# Altium schematic sheet Sheet1.SchDoc
size Letter
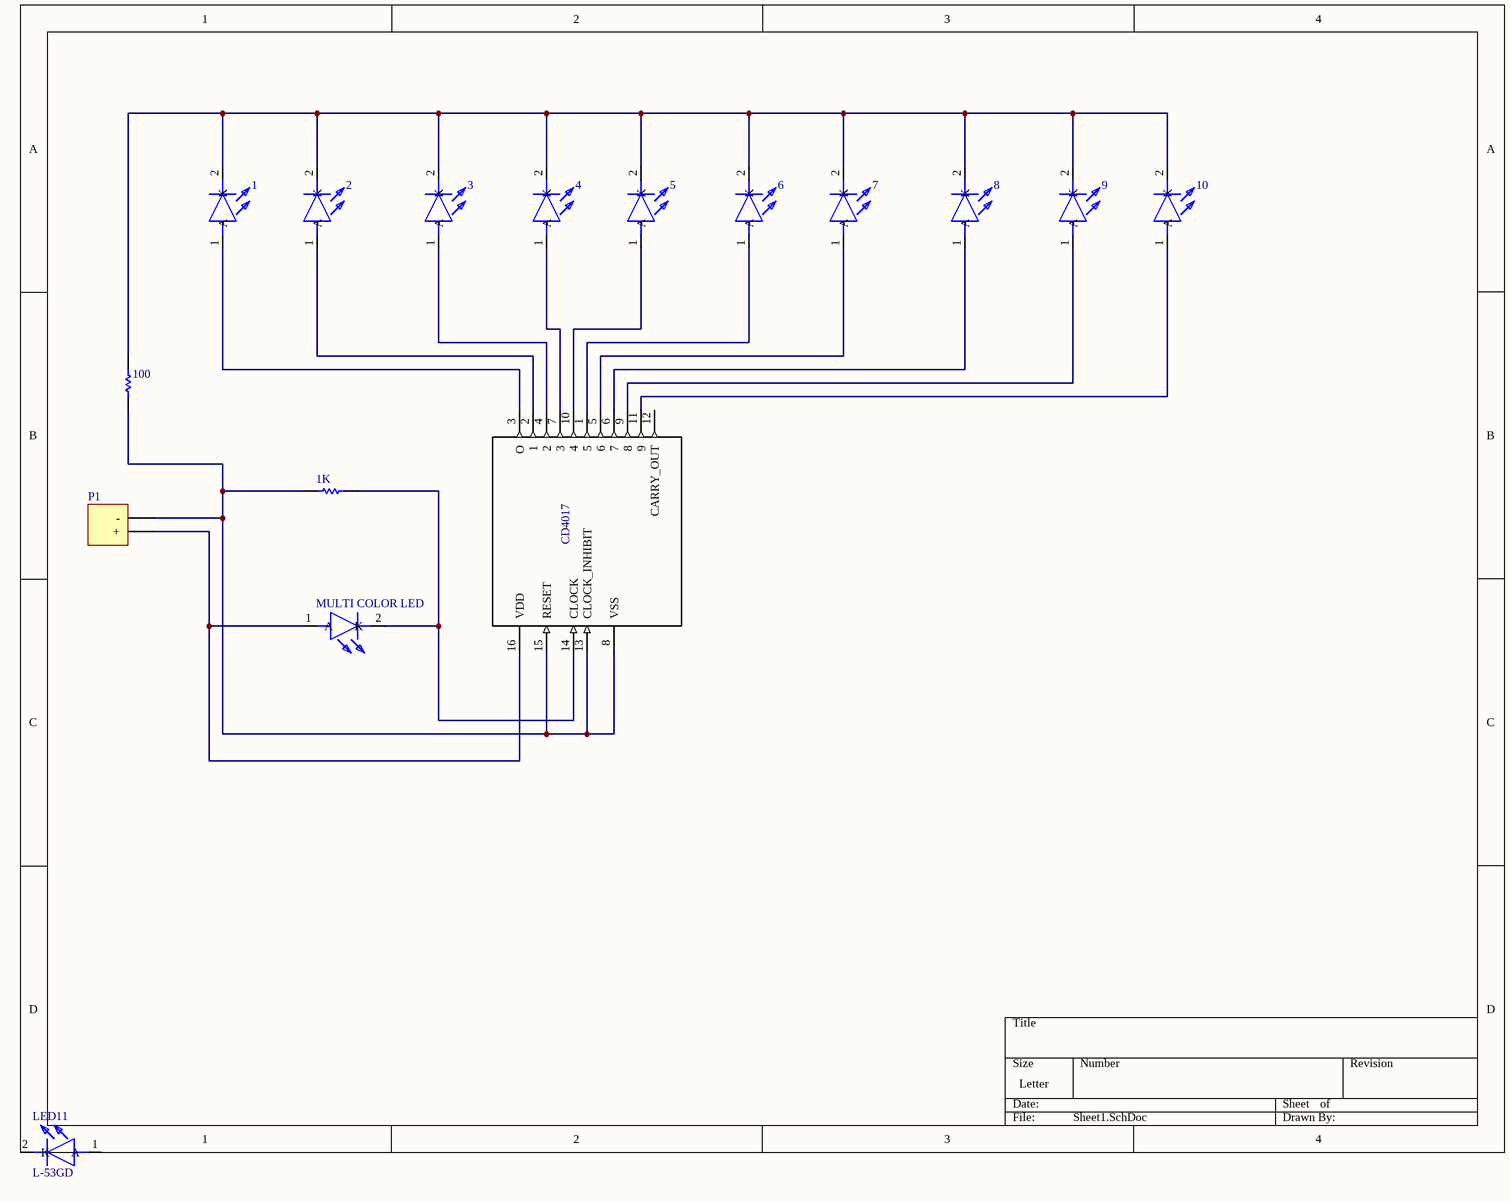
[diagram p0: Sheet1.SchDoc]

## Parts
1  L-53GD  [L-53GD]  (value not drawn)
1K  Res1  [AXIAL-0.3]  (value not drawn)
2  L-53GD  [L-53GD]  (value not drawn)
3  L-53GD  [L-53GD]  (value not drawn)
4  L-53GD  [L-53GD]  (value not drawn)
5  L-53GD  [L-53GD]  (value not drawn)
6  L-53GD  [L-53GD]  (value not drawn)
7  L-53GD  [L-53GD]  (value not drawn)
8  L-53GD  [L-53GD]  (value not drawn)
9  L-53GD  [L-53GD]  (value not drawn)
10  L-53GD  [L-53GD]  (value not drawn)
100  Res1  [AXIAL-0.3]  (value not drawn)
CD4017  CD4017BE  [*DIP254P762X508-16]  (value not drawn)
LED11  L-53GD  [L-53GD]
MULTI_COLOR_LED  L-53GD  [L-53GD]  (value not drawn)
P1  Header 2  [HDR1X2]  (value not drawn)

## Nets
Net1_1: 1.1(A) CD4017.3(O)
Net1_2: 1.2(K) 2.2(K) 3.2(K) 4.2(K) 5.2(K) 6.2(K) 7.2(K) 8.2(K) 9.2(K) 10.2(K) 100.2
Net1K_1: 1K.1 100.1 CD4017.8(VSS) CD4017.13(CLOCK_INHIBIT) CD4017.15(RESET) P1.2(-)
Net1K_2: 1K.2 CD4017.14(CLOCK) MULTI_COLOR_LED.2(K)
Net2_1: 2.1(A) CD4017.2(1)
Net3_1: 3.1(A) CD4017.4(2)
Net4_1: 4.1(A) CD4017.7(3)
Net5_1: 5.1(A) CD4017.10(4)
Net6_1: 6.1(A) CD4017.1(5)
Net7_1: 7.1(A) CD4017.5(6)
Net8_1: 8.1(A) CD4017.6(7)
Net9_1: 9.1(A) CD4017.9(8)
Net10_1: 10.1(A) CD4017.11(9)
NetCD4017_16: CD4017.16(VDD) MULTI_COLOR_LED.1(A) P1.1(+)

Not connected (* = marked no-connect by the designer): CD4017 12(CARRY_OUT); LED11 1(A) 2(K)

## Library data of the parts
1-10 LED11 MULTI_COLOR_LED = L-53GD: LED; Manufacturer_Name: Kingbright; Allied_Number: 70424261; Datasheet Link: http://docs-emea.rs-online.com/webdocs/151e/0900766b8151e408.pdf; Manufacturer_Part_Number: L-53GD; Mouser Part Number: N/A; Mouser Price/Stock: https://www.mouser.com/Search/Refine.aspx?Keyword=N%2FA; RS Part Number: 2286004A; RS Price/Stock: http://uk.rs-online.com/web/p/products/2286004A; Allied Price/Stock: http://www.alliedelec.com/kingbright-l-53gd/70424261/
1K 100 = Res1: Resistor; Value: 1K; Published: 8-Jun-2000; LatestRevisionDate: 17-Jul-2002; LatestRevisionNote: Re-released for DXP Platform.; PackageReference: AXIAL-0.3; Publisher: Altium Limited; PackageDescription: Axial Device, Thru-Hole; 2 Leads; 0.3 in Pin Spacing
CD4017 = CD4017BE: IC Mos 4017/CD4017BE HARRIS; MF: Texas; SnapEDA_Link: https://www.snapeda.com/parts/CD4017BE/Texas%20Instruments/view-part/?ref=snap; Availability: Unavailable; Price: None; MP: CD4017BE; Package: DIP-16 Intersil; Value: *
P1 = Header 2: Header, 2-Pin; LatestRevisionDate: 17-Jul-2002; LatestRevisionNote: Re-released for DXP Platform.; Publisher: Altium Limited